# EAGLE schematic Extender_Jumper (EAGLE 9.6.2)
COMPANY: ADAFRUIT INDUSTRIES; DRAWN: KTOWN; REV: A
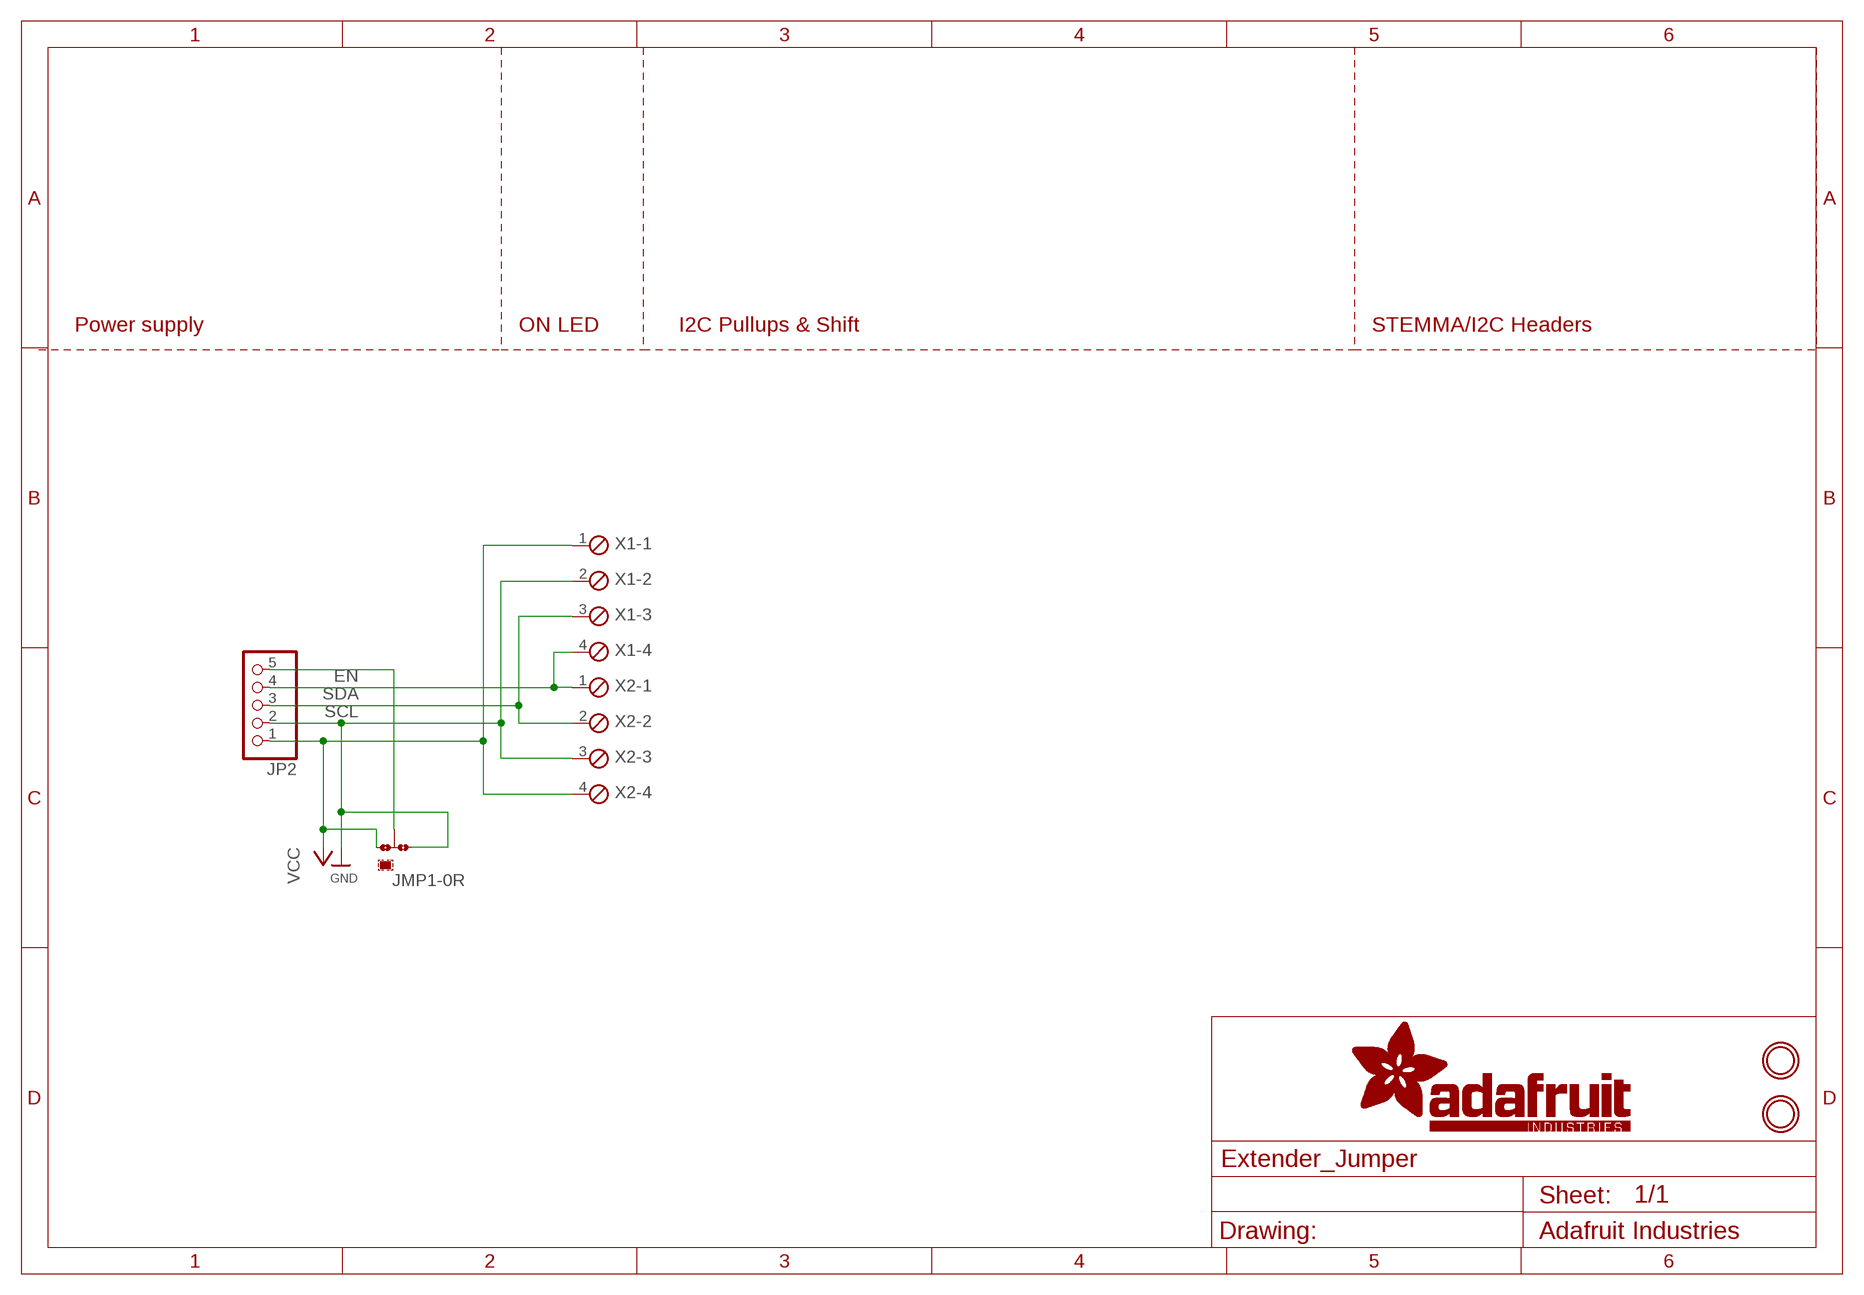
[diagram p0: schematic, sheet 1]

## Parts
JMP1  0R-JUMPA  [A0R-JMP]
JP2  HEADER-1X570MIL  [1X05_ROUND_70]
U$19  MOUNTINGHOLE2.5  [MOUNTINGHOLE_2.5_PLATED]
U$21  MOUNTINGHOLE2.5  [MOUNTINGHOLE_2.5_PLATED]
X1  MPT4  [4POL254]
X2  MPT4  [4POL254]

## Nets
EN: JMP1.2 JP2.5
GND [highpower]: JMP1.3 JP2.2 X1.2 X2.3
SCL: JP2.3 X1.3 X2.2
SDA: JP2.4 X1.4 X2.1
VCC [highpower]: JMP1.1 JP2.1 X1.1 X2.4

## Notes on the sheet
- Power supply | ON LED | I2C Pullups & Shift | STEMMA/I2C Headers

## Library data of the parts
JMP1 = jump-0r-smd:0R-JUMP: SMD 0R 0805 Jumper
JP2 = microbuilder:HEADER-1X5: PIN HEADER
U$19 U$21 = microbuilder:MOUNTINGHOLE: Mounting Hole For #2 screws (0.086"/2.18mm width, 0.094"/2.4mm hole) use 2.5mm; BOM: EXCLUDE
X1 X2 = con-phoenix-254:MPT4: PHOENIX CONNECTOR; OC_FARNELL: unknown; OC_NEWARK: unknown

## Net classes
1 highpower: width 0.406 mm, drill 0.483 mm
2 lowpower: width 0.305 mm, drill 0.483 mm